# EAGLE design a78-flashcart-plus (EAGLE 7.0.0)
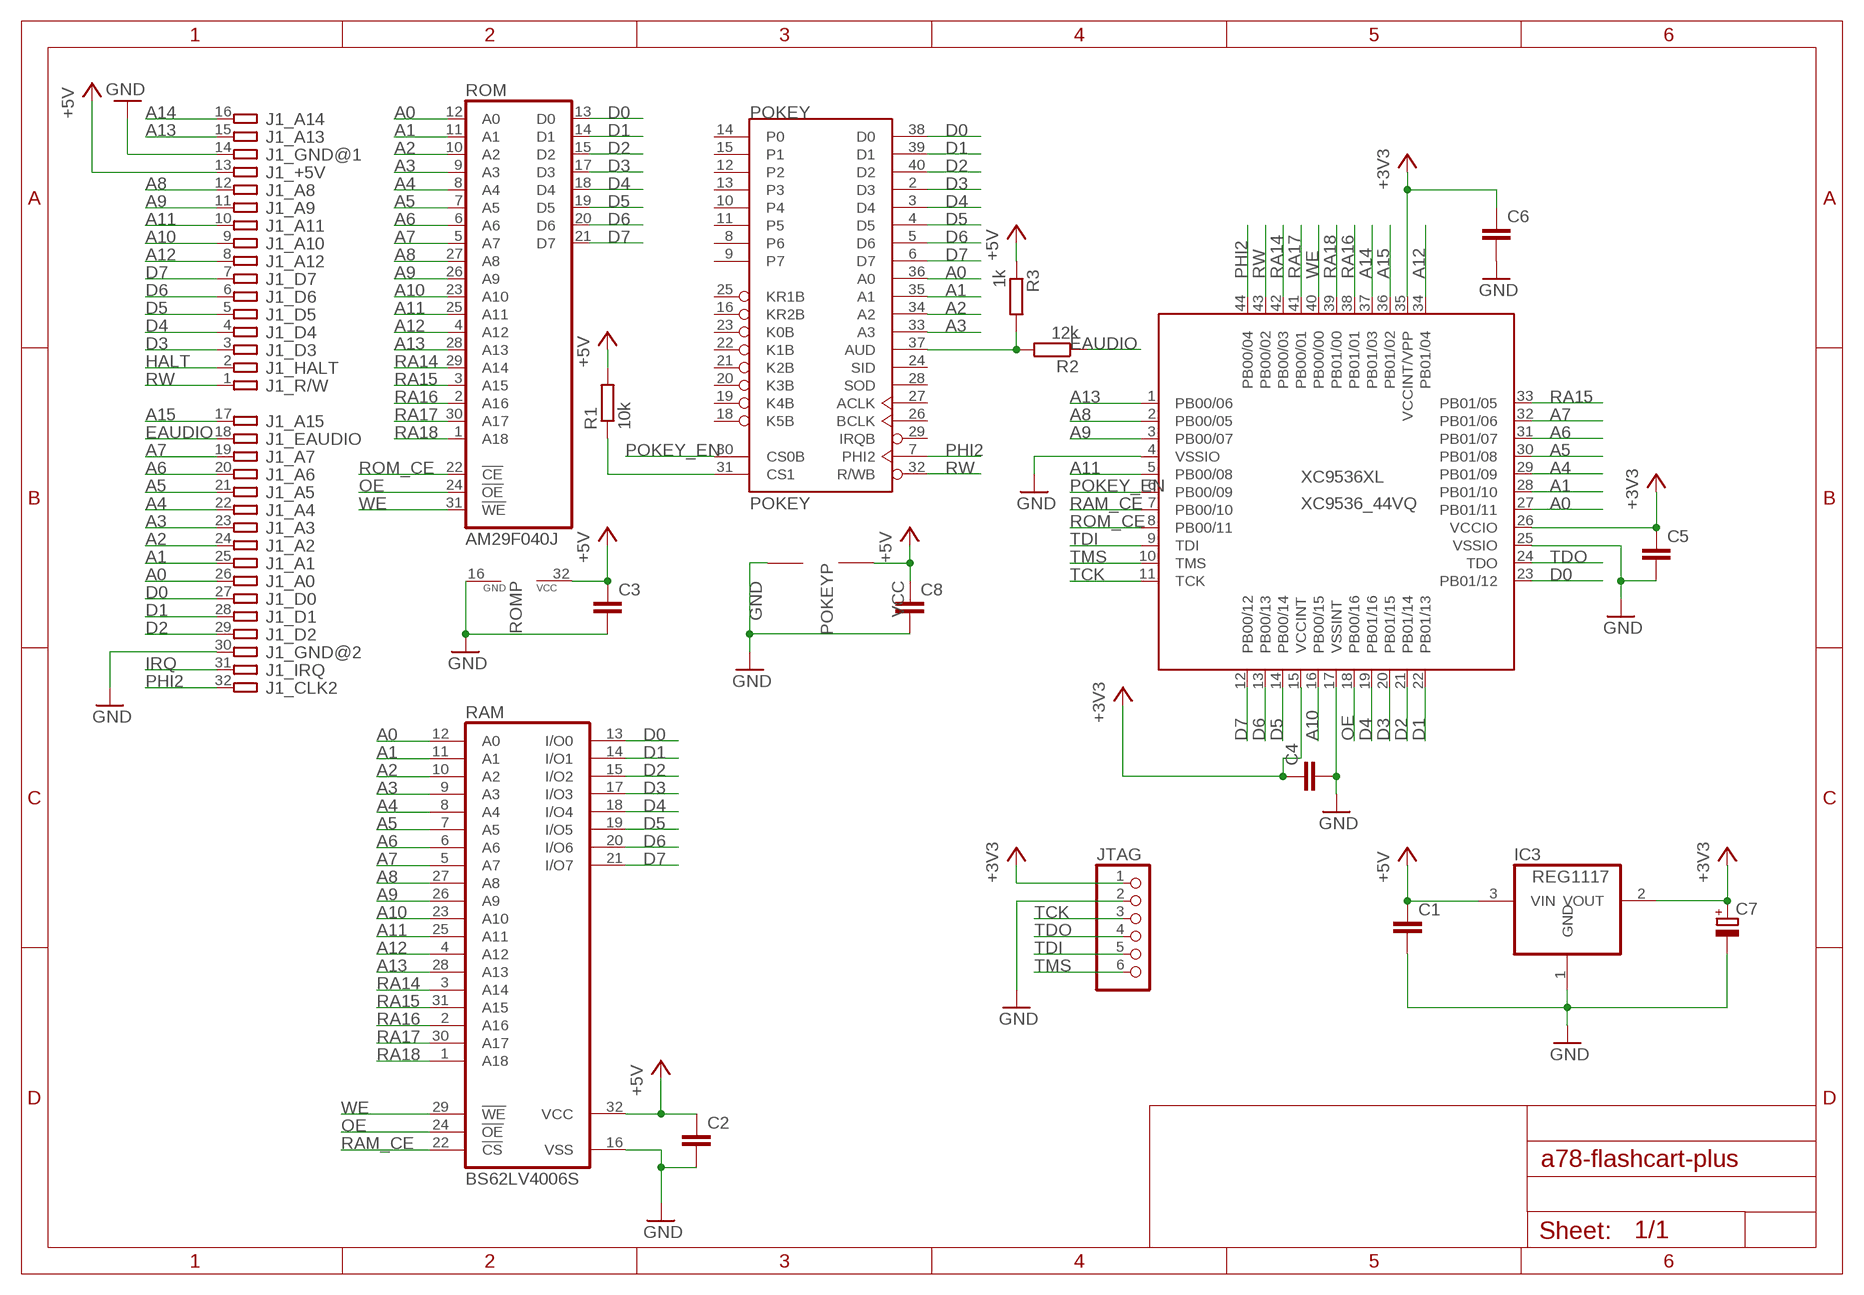
[diagram p0: schematic, sheet 1]

## Parts
C1  C-EUC0603  [C0603]
C2  C-EUC0603  [C0603]
C3  C-EUC0603  [C0603]
C4  C-EUC0603  [C0603]
C5  C-EUC0603  [C0603]
C6  C-EUC0603  [C0603]
C7  CPOL-EUSMCC  [SMC_C]
C8  C-EUC0603  [C0603]
IC3  REG1117  [SOT223]
J1  ATARI-7800-LARGE  [ATARI-7800-LARGE]
JTAG  PINHD-1X6  [1X06]
POKEY  POKEY  [DIL40]
R1  10k  R-EU_R0603  [R0603]
R2  12k  R-EU_R0603  [R0603]
R3  1k  R-EU_R0603  [R0603]
RAM  BS62LV4006S  [SOP-32]
ROM  AM29F040J  [PLCC32R]
XC9536XL  XC9536_44VQ  [SQFP-S-10X10-44]

## Nets
+3V3: C4.1 C5.1 C6.1 C7.+ IC3.2(VOUT) JTAG.1 XC9536XL.15(VCCINT) XC9536XL.26(VCCIO) XC9536XL.35(VCCINT/VPP)
+5V: C1.1 C2.1 C3.1 C8.1 IC3.3(VIN) J1.13 POKEY.17(VCC) R1.2 R3.1 RAM.32(VCC) ROM.32(VCC)
A0: J1.26 POKEY.36(A0) RAM.12(A0) ROM.12(A0) XC9536XL.27(PB01/11)
A1: J1.25 POKEY.35(A1) RAM.11(A1) ROM.11(A1) XC9536XL.28(PB01/10)
A2: J1.24 POKEY.34(A2) RAM.10(A2) ROM.10(A2)
A3: J1.23 POKEY.33(A3) RAM.9(A3) ROM.9(A3)
A4: J1.22 RAM.8(A4) ROM.8(A4) XC9536XL.29(PB01/09)
A5: J1.21 RAM.7(A5) ROM.7(A5) XC9536XL.30(PB01/08)
A6: J1.20 RAM.6(A6) ROM.6(A6) XC9536XL.31(PB01/07)
A7: J1.19 RAM.5(A7) ROM.5(A7) XC9536XL.32(PB01/06)
A8: J1.12 RAM.27(A8) ROM.27(A8) XC9536XL.2(PB00/05)
A9: J1.11 RAM.26(A9) ROM.26(A9) XC9536XL.3(PB00/07)
A10: J1.9 RAM.23(A10) ROM.23(A10) XC9536XL.16(PB00/15)
A11: J1.10 RAM.25(A11) ROM.25(A11) XC9536XL.5(PB00/08)
A12: J1.8 RAM.4(A12) ROM.4(A12) XC9536XL.34(PB01/04)
A13: J1.15 RAM.28(A13) ROM.28(A13) XC9536XL.1(PB00/06)
A14: J1.16 XC9536XL.37(PB01/03)
A15: J1.17 XC9536XL.36(PB01/02)
D0: J1.27 POKEY.38(D0) RAM.13(I/O0) ROM.13(D0) XC9536XL.23(PB01/12)
D1: J1.28 POKEY.39(D1) RAM.14(I/O1) ROM.14(D1) XC9536XL.22(PB01/13)
D2: J1.29 POKEY.40(D2) RAM.15(I/O2) ROM.15(D2) XC9536XL.21(PB01/14)
D3: J1.3 POKEY.2(D3) RAM.17(I/O3) ROM.17(D3) XC9536XL.20(PB01/15)
D4: J1.4 POKEY.3(D4) RAM.18(I/O4) ROM.18(D4) XC9536XL.19(PB01/16)
D5: J1.5 POKEY.4(D5) RAM.19(I/O5) ROM.19(D5) XC9536XL.14(PB00/14)
D6: J1.6 POKEY.5(D6) RAM.20(I/O6) ROM.20(D6) XC9536XL.13(PB00/13)
D7: J1.7 POKEY.6(D7) RAM.21(I/O7) ROM.21(D7) XC9536XL.12(PB00/12)
DJGJGFJG: POKEY.31(CS1) R1.1
EAUDIO: J1.18 R2.1
GND: C1.2 C2.2 C3.2 C4.2 C5.2 C6.2 C7.- C8.2 IC3.1(GND) J1.14 J1.30 JTAG.2 POKEY.1(GND) RAM.16(VSS) ROM.16(GND) XC9536XL.4(VSSIO) XC9536XL.17(VSSINT) XC9536XL.25(VSSIO)
HALT: J1.2
IRQ: J1.31
N$3: POKEY.37(AUD) R2.2 R3.2
OE: RAM.24(!OE) ROM.24(!OE) XC9536XL.18(PB00/16)
PHI2: J1.32 POKEY.7(PHI2) XC9536XL.44(PB00/04)
POKEY_EN: POKEY.30(CS0B) XC9536XL.6(PB00/09)
RA14: RAM.3(A14) ROM.29(A14) XC9536XL.42(PB00/03)
RA15: RAM.31(A15) ROM.3(A15) XC9536XL.33(PB01/05)
RA16: RAM.2(A16) ROM.2(A16) XC9536XL.38(PB01/01)
RA17: RAM.30(A17) ROM.30(A17) XC9536XL.41(PB00/01)
RA18: RAM.1(A18) ROM.1(A18) XC9536XL.39(PB01/00)
RAM_CE: RAM.22(!CS) XC9536XL.7(PB00/10)
ROM_CE: ROM.22(!CE) XC9536XL.8(PB00/11)
RW: J1.1 POKEY.32(R/WB) XC9536XL.43(PB00/02)
TCK: JTAG.3 XC9536XL.11(TCK)
TDI: JTAG.5 XC9536XL.9(TDI)
TDO: JTAG.4 XC9536XL.24(TDO)
TMS: JTAG.6 XC9536XL.10(TMS)
WE: RAM.29(!WE) ROM.31(!WE) XC9536XL.40(PB00/00)
Unconnected: POKEY.8(P6) POKEY.9(P7) POKEY.10(P4) POKEY.11(P5) POKEY.12(P2) POKEY.13(P3) POKEY.14(P0) POKEY.15(P1) POKEY.16(KR2B) POKEY.18(K5B) POKEY.19(K4B) POKEY.20(K3B) POKEY.21(K2B) POKEY.22(K1B) POKEY.23(K0B) POKEY.24(SID) POKEY.25(KR1B) POKEY.26(BCLK) POKEY.27(ACLK) POKEY.28(SOD) POKEY.29(IRQB)

## Library data of the parts
C1-C6 C8 = resistor:C-EU: CAPACITOR, European symbol
C7 = resistor:CPOL-EU: POLARIZED CAPACITOR, European symbol
IC3 = burr-brown:REG1117: 800mA and 1A Low Dropout (LDO) Positive Regulator 1.8V, 2.5V, 2.85V, 3.3V, 5V, and Adj; MPN: REG1117; OC_FARNELL: 1097566; OC_NEWARK: 14P6981
J1 = atari-7800-tdi:ATARI-7800: Atari 7800 cartridge board
JTAG = adafruit:PINHD-1X6: PIN HEADER
POKEY = atari-chips-mod:POKEY
R1-R3 = resistor:R-EU_: RESISTOR, European symbol
RAM = memory-bsi:BS62LV4006
ROM = am29-memory:AM29F040J: 4-Megabit FLASH MEMORY (512 K x 8 bit) 5 V-only
XC9536XL = xilinx-xc9:XC9536_44VQ: xc9536_pc44 XC9500 In-System Programmable CPLD Family Auto generated by make-symbol-device-package-bsdl.ulp Rev. 34 Source: xc9536_vq44.bsd; MPN: XC9536-15VQG44C; OC_FARNELL: 1193227; OC_NEWARK: 98K3377

## Board
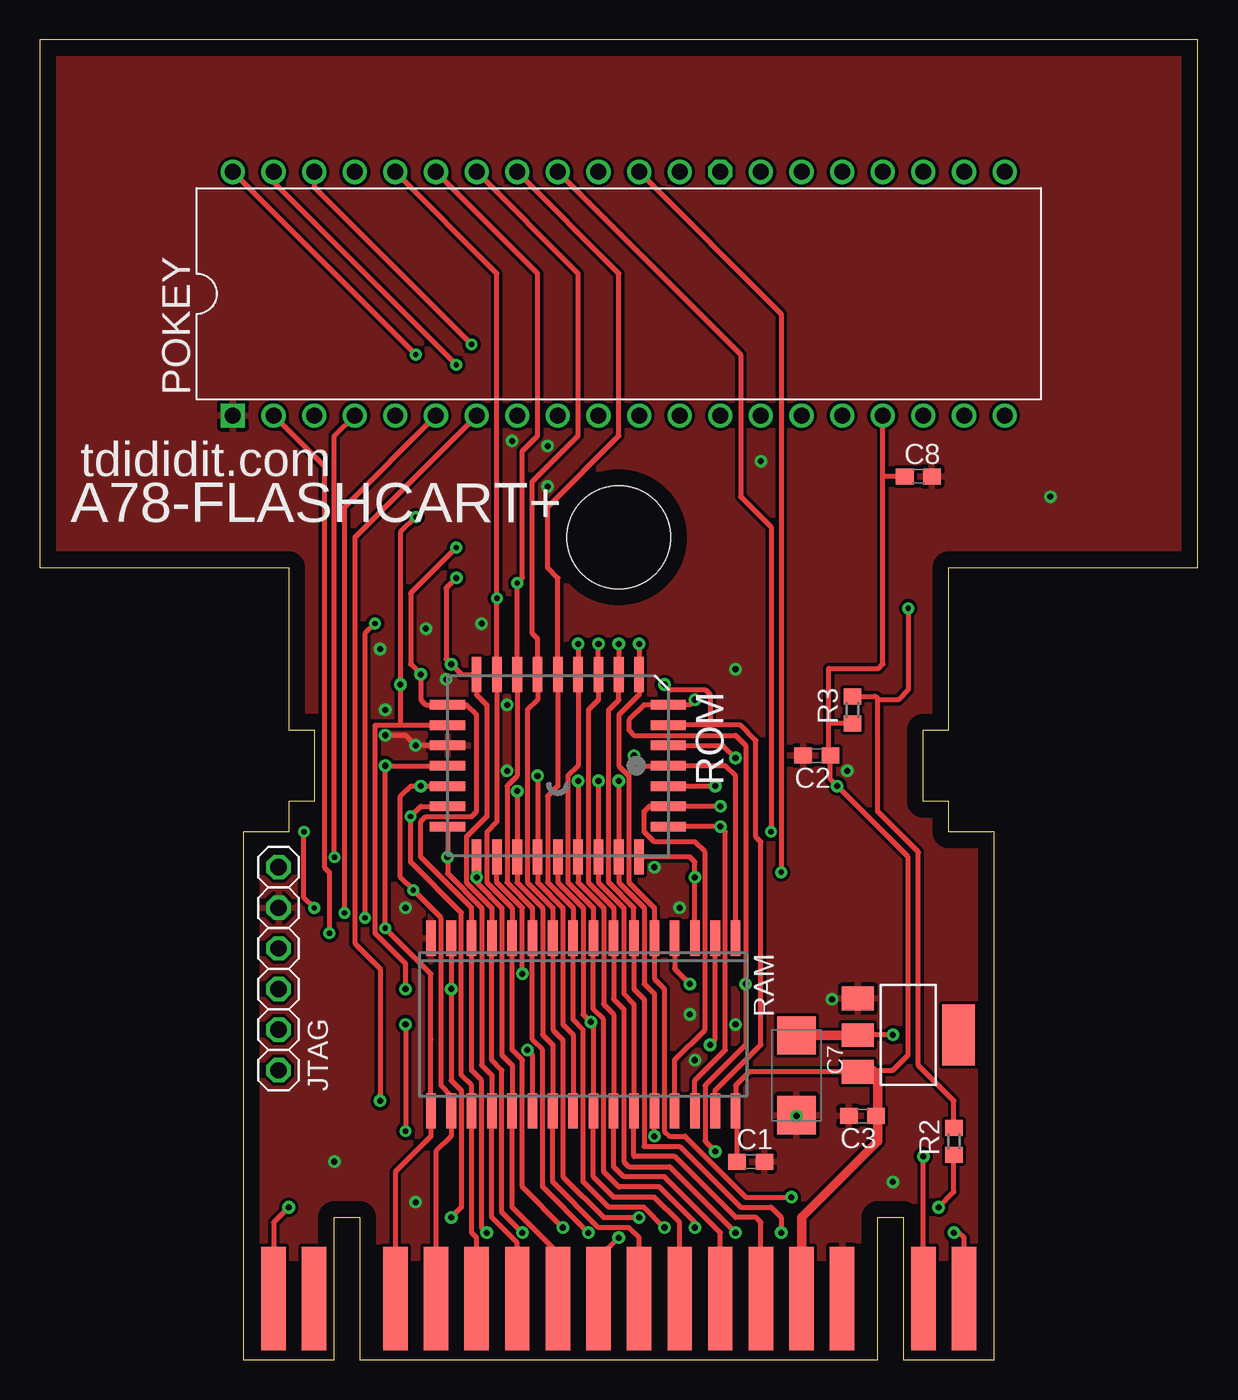
[diagram p1: board, top side]
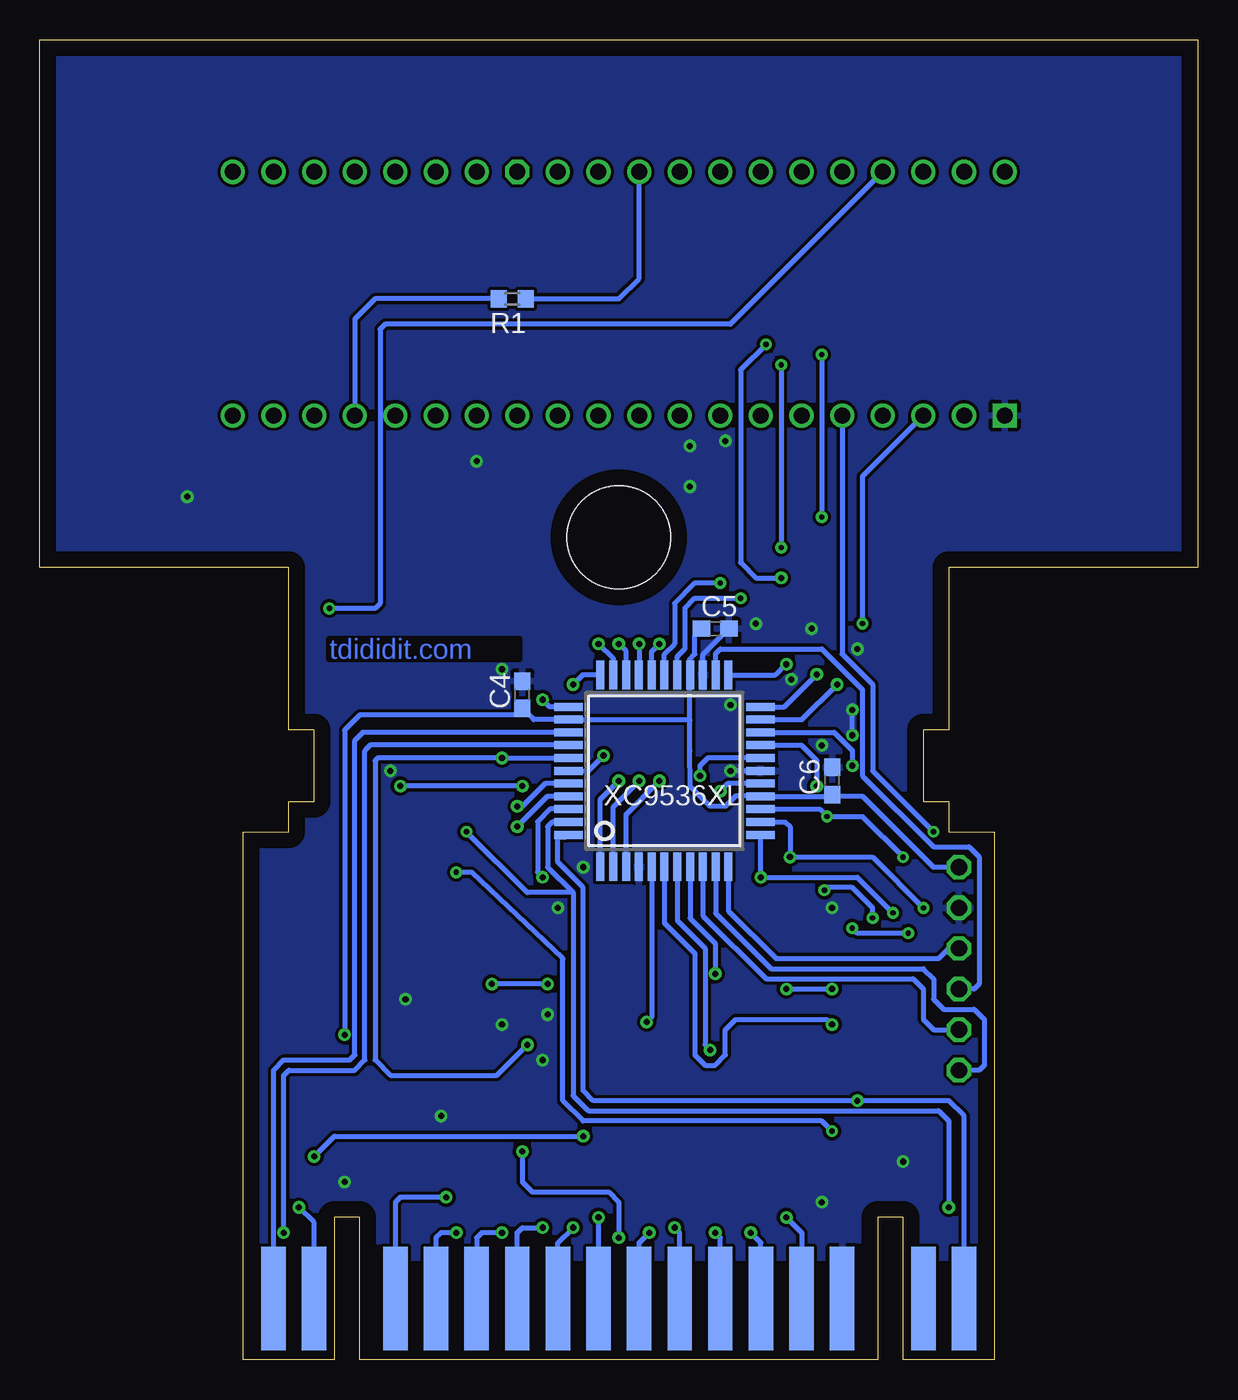
[diagram p2: board, bottom side, seen from below]

Size 72.39 x 82.55 mm. Coordinates in mm from the lower left corner, seen from the top.
Copper layers (1*16): Top 0.035mm / dielectric 1.5mm / Bottom 0.035mm
Design rules "default": minimum track width 10mil, minimum drill 24mil, track to track 8mil, track to pad 8mil, pad to pad 8mil, via to via 8mil, smd to smd 8mil, copper to edge 40mil, drill to drill 8mil, minimum pad ring 10mil, minimum via ring 8mil, stop-mask expansion 4mil, vias tented up to drill 0mil, thermal gap 10mil

### Footprints (pad centres in the part's own frame; a part is rotated, then mirrored left to right if it is on the bottom)
C0603 = smd 1.1 x 1: 1 -0.85,0; 2 0.85,0
SMC_C = smd 2.4 x 2.4: + -2.5,0; - 2.5,0
SOT223 = smd 1.499 x 2.007: 1 -2.261,-3.15; 2 0.025,-3.15; 3 2.311,-3.15 | smd 3.81 x 2.007: 4 0,3.15
ATARI-7800-LARGE = smd 1.524 x 6.477: 1 -21.59,3.81; 2 -19.05,3.81; 3 -13.97,3.81; 4 -11.43,3.81; 5 -8.89,3.81; 6 -6.35,3.81; 7 -3.81,3.81; 8 -1.27,3.81; 9 1.27,3.81; 10 3.81,3.81; 11 6.35,3.81; 12 8.89,3.81; 13 11.43,3.81; 14 13.97,3.81; 15 19.05,3.81; 16 21.59,3.81 | smd 1.524 x 6.477 bottom: 17 21.59,3.81; 18 19.05,3.81; 19 13.97,3.81; 20 11.43,3.81; 21 8.89,3.81; 22 6.35,3.81; 23 3.81,3.81; 24 1.27,3.81; 25 -1.27,3.81; 26 -3.81,3.81; 27 -6.35,3.81; 28 -8.89,3.81; 29 -11.43,3.81; 30 -13.97,3.81; 31 -19.05,3.81; 32 -21.59,3.81 | hole 6.452: 0,51.435
1X06 = drill 1.016 octagon: 1 -6.35,0; 2 -3.81,0; 3 -1.27,0; 4 1.27,0; 5 3.81,0; 6 6.35,0
DIL40 = drill 1 square: 1 -24.13,-7.62 | drill 1: 2 -21.59,-7.62; 3 -19.05,-7.62; 4 -16.51,-7.62; 5 -13.97,-7.62; 6 -11.43,-7.62; 7 -8.89,-7.62; 8 -6.35,-7.62; 9 -3.81,-7.62; 10 -1.27,-7.62; 11 1.27,-7.62; 12 3.81,-7.62; 13 6.35,-7.62; 14 8.89,-7.62; 15 11.43,-7.62; 16 13.97,-7.62; 17 16.51,-7.62; 18 19.05,-7.62; 19 21.59,-7.62; 20 24.13,-7.62; 21 24.13,7.62; 22 21.59,7.62; 23 19.05,7.62; 24 16.51,7.62; 25 13.97,7.62; 26 11.43,7.62; 27 8.89,7.62; 29 3.81,7.62; 30 1.27,7.62; 31 -1.27,7.62; 32 -3.81,7.62; 33 -6.35,7.62; 34 -8.89,7.62; 35 -11.43,7.62; 36 -13.97,7.62; 37 -16.51,7.62; 38 -19.05,7.62; 39 -21.59,7.62; 40 -24.13,7.62 | drill 1 octagon: 28 6.35,7.62
R0603 = smd 1 x 1.1: 1 -0.85,0; 2 0.85,0
SOP-32 = smd 0.6 x 2.2: 1 -9.525,-5.4; 2 -8.255,-5.4; 3 -6.985,-5.4; 4 -5.715,-5.4; 5 -4.445,-5.4; 6 -3.175,-5.4; 7 -1.905,-5.4; 8 -0.635,-5.4; 9 0.635,-5.4; 10 1.905,-5.4; 11 3.175,-5.4; 12 4.445,-5.4; 13 5.715,-5.4; 14 6.985,-5.4; 15 8.255,-5.4; 16 9.525,-5.4; 17 9.525,5.4; 18 8.255,5.4; 19 6.985,5.4; 20 5.715,5.4; 21 4.445,5.4; 22 3.175,5.4; 23 1.905,5.4; 24 0.635,5.4; 25 -0.635,5.4; 26 -1.905,5.4; 27 -3.175,5.4; 28 -4.445,5.4; 29 -5.715,5.4; 30 -6.985,5.4; 31 -8.255,5.4; 32 -9.525,5.4
PLCC32R = smd 0.6 x 2.2: 1 0,6.9; 2 -1.27,6.9; 3 -2.54,6.9; 4 -3.81,6.9; 14 -3.81,-6.9; 15 -2.54,-6.9; 16 -1.27,-6.9; 17 0,-6.9; 18 1.27,-6.9; 19 2.54,-6.9; 20 3.81,-6.9; 30 3.81,6.9; 31 2.54,6.9; 32 1.27,6.9 | smd 2.2 x 0.6: 5 -5.7,5.08; 6 -5.7,3.81; 7 -5.7,2.54; 8 -5.7,1.27; 9 -5.7,0; 10 -5.7,-1.27; 11 -5.7,-2.54; 12 -5.7,-3.81; 13 -5.7,-5.08; 21 5.7,-5.08; 22 5.7,-3.81; 23 5.7,-2.54; 24 5.7,-1.27; 25 5.7,0; 26 5.7,1.27; 27 5.7,2.54; 28 5.7,3.81; 29 5.7,5.08
SQFP-S-10X10-44 = smd 0.5 x 1.8: 1 -4,-6; 2 -3.2,-6; 3 -2.4,-6; 4 -1.6,-6; 5 -0.8,-6; 6 0,-6; 7 0.8,-6; 8 1.6,-6; 9 2.4,-6; 10 3.2,-6; 11 4,-6; 23 4,6; 24 3.2,6; 25 2.4,6; 26 1.6,6; 27 0.8,6; 28 0,6; 29 -0.8,6; 30 -1.6,6; 31 -2.4,6; 32 -3.2,6; 33 -4,6 | smd 1.8 x 0.5: 12 6,-4; 13 6,-3.2; 14 6,-2.4; 15 6,-1.6; 16 6,-0.8; 17 6,0; 18 6,0.8; 19 6,1.6; 20 6,2.4; 21 6,3.2; 22 6,4; 34 -6,4; 35 -6,3.2; 36 -6,2.4; 37 -6,1.6; 38 -6,0.8; 39 -6,0; 40 -6,-0.8; 41 -6,-1.6; 42 -6,-2.4; 43 -6,-3.2; 44 -6,-4

### Placement (x,y rotation side)
C1  44.45,12.38 0 top
C2  48.58,37.78 180 top
C3  51.43,15.24 180 top
C4  42.23,41.59 90 bottom
C5  30.16,45.72 0 bottom
C6  22.86,36.2 90 bottom
C7  47.31,17.78 270 top
C8  54.93,55.25 0 top
IC3  54.29,20.32 270 top
J1  36.2,0 0 top
JTAG  14.92,24.45 270 top
POKEY  36.2,66.67 0 top
R1  42.86,66.36 180 bottom
R2  57.15,13.65 90 top
R3  50.8,40.64 90 top
RAM  33.97,20.95 180 top
ROM  32.38,37.15 270 top
XC9536XL  33.34,36.83 0 bottom

### Tracks (layer width: path | path; a pad name or v marks a point on that pad's centre or on a via)
+3V3  (via drill 0.38)
  Top 0.305: v53.34,20.32 51.17,20.32 IC3.2
  Top 0.61: C7.+ 51.13,20.28 IC3.2
  Bottom 0.305: JTAG.1 16.51,30.8 20.95,35.24 22.76,35.24 C6.1 22.97,35.23 XC9536XL.15 27.35,35.24 28.89,35.24 29.53,34.61 30.48,34.61 31.74,35.87 31.75,38.1 31.75,40.01 | 31.75,40.01 31.77,40.03 XC9536XL.35 41.52,40.03 C4.1 42.65,40.32 52.39,40.32 53.34,39.37 v53.34,20.32 | 31.75,40.01 31.75,42.82 XC9536XL.26 31.76,43.59 31.76,43.8 31.43,44.13 31.43,45.3 C5.1
+5V  (via drill 0.38)
  Top 0.305: IC3.3 44.36,18.01 43.5,17.14 RAM.32 43.6,15.45 C1.1 | ROM.32 v42.23,35.88 | 52.07,18.1 53.34,18.1 54.29,19.05 54.29,31.43 v49.85,35.88 49.43,36.3 C2.1 49.34,37.87 49.34,40.01 | 52.7,55.25 52.7,43.5 52.45,43.24 49.34,43.24 49.34,40.01 | 52.7,55.25 POKEY.17 | R3.1 49.55,39.79 arc-90 49.34,40.01 | C8.1 52.7,55.25
  Top 0.61: J1.13 47.62,8.89 52.39,13.65 52.39,15.24 | 52.39,15.24 52.39,17.78 52.07,18.1 51.23,18.1 IC3.3 | C3.1 52.39,15.24
  Bottom 0.305: v42.23,35.88 v49.85,35.88 | R1.2 51.43,66.36 52.7,65.09 POKEY.17
A0  (via drill 0.33, 0.38)
  Top 0.305: v32.7,8.26 30.16,10.79 30.16,18.73 29.53,19.37 RAM.12 29.53,28.26 27.94,29.84 27.94,33.02 28.57,33.66 ROM.12 v28.57,47.62 28.57,67.94 POKEY.36
  Bottom 0.305: J1.26 32.38,7.94 v32.7,8.26 | XC9536XL.27 32.54,43.98 32.07,44.45 32.07,46.99 31.43,47.62 v28.57,47.62
A1  (via drill 0.33, 0.38)
  Top 0.305: v34.29,7.94 31.43,10.79 31.43,19.37 30.8,20 RAM.11 30.8,28.26 29.21,29.84 29.21,35.88 29.84,36.51 ROM.11 v29.84,48.58 30.16,48.9 30.16,56.83 31.11,57.79 31.11,67.94 POKEY.35
  Bottom 0.305: J1.25 34.92,7.3 v34.29,7.94 | XC9536XL.28 33.34,44.13 32.7,44.77 32.7,47.31 31.43,48.58 v29.84,48.58
A2  (via drill 0.38)
  Top 0.305: v37.46,8.89 35.24,8.89 32.7,11.43 32.7,20 32.07,20.64 RAM.10 32.07,28.26 30.48,29.84 30.48,40.64 31.11,41.27 ROM.10 31.11,45.09 30.8,45.4 30.8,54.93 33.66,57.79 33.66,67.94 POKEY.34
  Bottom 0.305: v37.46,8.89 J1.24
A3  (via drill 0.38)
  Top 0.305: v39.05,8.26 37.78,9.53 35.56,9.53 33.97,11.11 33.97,20.64 33.34,21.27 RAM.9 33.34,28.26 31.75,29.84 31.75,35.24 32.38,35.88 ROM.9 32.38,48.9 31.75,49.53 31.75,53.34 36.2,57.79 36.2,67.94 POKEY.33
  Bottom 0.305: J1.23 40,7.3 v39.05,8.26
A4  (via drill 0.38)
  Top 0.305: v40.96,8.26 40.96,8.57 38.73,10.79 36.2,10.79 35.24,11.75 35.24,21.27 34.61,21.91 RAM.8 34.61,28.26 33.02,29.84 33.02,36.51 33.66,37.15 ROM.8 v33.66,44.77
  Bottom 0.305: J1.22 42.54,7.94 42.23,8.26 v40.96,8.26 | XC9536XL.29 34.14,44.29 v33.66,44.77
A5  (via drill 0.38)
  Top 0.305: v43.5,7.94 39.37,12.06 36.83,12.06 36.51,12.38 36.51,21.91 35.88,22.54 RAM.7 35.88,28.26 34.29,29.84 34.29,40.64 34.92,41.27 ROM.7 v34.92,44.77
  Bottom 0.305: v43.5,7.94 44.77,7.94 45.09,7.62 J1.21 | v34.92,44.77 ROM.7 XC9536XL.30
A6  (via drill 0.38)
  Top 0.305: v46.35,7.94 46.35,8.89 45.72,9.53 43.81,9.53 40,13.34 37.78,13.34 37.78,22.54 37.15,23.18 RAM.6 37.15,28.26 35.56,29.84 35.56,40.64 36.2,41.27 ROM.6 v36.2,44.77
  Bottom 0.305: v46.35,7.94 47.31,7.94 47.62,7.62 J1.20 | XC9536XL.31 35.74,44.31 v36.2,44.77
A7  (via drill 0.38)
  Top 0.305: v46.99,10.16 44.13,10.16 40.32,13.97 39.37,13.97 39.05,14.29 39.05,23.18 38.42,23.81 RAM.5 38.42,28.26 36.83,29.84 36.83,36.51 36.2,37.15 36.2,40.32 37.46,41.59 ROM.5 v37.46,44.77
  Bottom 0.305: v46.99,10.16 49.85,10.16 50.16,9.84 J1.19 | XC9536XL.32 36.54,43.84 v37.46,44.77
A8  (via drill 0.38)
  Top 0.305: J1.12 45.09,8.57 44.77,8.89 43.5,8.89 39.69,12.7 37.15,12.7 RAM.27 37.15,22.22 36.51,22.86 36.51,28.26 34.92,29.84 ROM.27 v34.92,36.2
  Bottom 0.305: XC9536XL.2 36.54,34.58 v34.92,36.2
A9  (via drill 0.38)
  Top 0.305: J1.11 42.54,7.94 39.05,11.43 36.51,11.43 35.88,12.06 RAM.26 35.88,21.59 35.24,22.22 35.24,28.26 33.66,29.84 ROM.26 v33.66,36.2
  Bottom 0.305: XC9536XL.3 35.74,34.11 v33.66,36.2
A10  (via drill 0.38)
  Top 0.305: J1.9 37.46,7.62 36.83,8.26 34.92,8.26 32.07,11.11 RAM.23 32.07,19.68 31.43,20.32 31.43,28.26 29.84,29.84 ROM.23 v29.84,35.56
  Bottom 0.305: XC9536XL.16 29.37,36.03 v29.84,35.56
A11  (via drill 0.38)
  Top 0.305: ROM.25 32.38,29.84 33.97,28.26 33.97,21.59 v34.45,21.11 34.61,20.95 RAM.25 34.61,11.43 35.88,10.16 38.42,10.16 40,8.57 J1.10
  Bottom 0.305: XC9536XL.5 34.14,21.42 v34.45,21.11
A12  (via drill 0.38)
  Top 0.305: v42.23,13.02 41.59,13.65 41.59,17.14 44.13,19.68 v44.13,23.49 44.13,38.42 43.5,39.05 37.15,39.05 36.83,39.37 36.83,40.01 37.78,40.96 ROM.4 40.64,40.96 v40.96,41.27 | v36.2,7.62 34.92,6.35 J1.8 | RAM.4 39.69,24.45 v40.64,23.49
  Bottom 0.305: v42.23,13.02 42.23,11.11 41.59,10.48 36.83,10.48 36.2,9.84 v36.2,7.62 | v40.64,23.49 v44.13,23.49 | XC9536XL.34 40.51,40.83 v40.96,41.27
A13  (via drill 0.38)
  Top 0.305: J1.15 v55.24,12.7 | v38.42,13.97 RAM.28 38.42,22.86 37.78,23.49 37.78,28.26 36.2,29.84 ROM.28 v36.2,36.2
  Bottom 0.305: v55.24,12.7 53.98,13.97 v38.42,13.97 | XC9536XL.1 37.34,35.05 v36.2,36.2
A14  (via drill 0.38)
  Top 0.305: J1.16 57.78,7.62 57.47,7.94 v57.15,7.94
  Bottom 0.305: v57.15,7.94 57.15,17.78 56.83,18.1 52.7,18.1 52.07,18.73 52.07,38.1 51.74,38.43 XC9536XL.37
A15
  Bottom 0.305: J1.17 57.78,18.1 57.15,18.73 53.02,18.73 52.7,19.05 52.7,38.73 52.21,39.23 XC9536XL.36
D0  (via drill 0.33, 0.38)
  Top 0.305: v30.16,7.94 28.89,9.21 28.89,18.1 28.26,18.73 RAM.13 28.26,28.26 26.67,29.84 26.67,32.7 27.94,33.97 27.94,40.94 27.3,41.58 ROM.13 26.37,42.85 v25.72,43.5 25.4,43.82 25.4,48.26 v26.03,48.9 | POKEY.38 17.14,73.34 v26.99,63.5
  Bottom 0.305: J1.27 29.84,7.62 v30.16,7.94 | XC9536XL.23 26.38,42.83 v25.72,43.5 | v26.99,63.5 28.57,61.91 28.57,49.85 27.62,48.9 v26.03,48.9
D1  (via drill 0.33, 0.38)
  Top 0.305: v27.94,7.94 27.62,8.26 27.62,17.46 26.99,18.1 RAM.14 26.99,28.26 23.81,31.43 23.81,33.66 24.13,33.97 26.99,33.97 27.3,34.29 27.3,40.32 26.67,40.96 ROM.14 24.13,40.96 23.81,41.27 v23.81,42.86 23.18,43.5 23.18,47.94 v26.03,50.8 | POKEY.39 14.6,73.66 v26.03,62.23
  Bottom 0.305: J1.28 27.3,7.3 v27.94,7.94 | XC9536XL.22 25.84,40.83 v23.81,42.86 | v26.03,62.23 v26.03,50.8
D2  (via drill 0.33, 0.38)
  Top 0.305: v25.72,8.89 26.35,9.53 26.35,16.83 25.72,17.46 v25.72,23.18 RAM.15 | 22.54,39.69 v22.54,42.23 22.54,51.75 v23.49,52.71 | v22.86,23.18 22.86,24.76 20.95,26.67 20.95,39.69 22.54,39.69 | 22.54,39.69 ROM.15 | POKEY.40 v23.49,62.87
  Bottom 0.305: v25.72,8.89 24.76,7.94 J1.29 | XC9536XL.21 24.74,40.03 v22.54,42.23 | v25.72,23.18 v22.86,23.18 | v23.49,62.87 v23.49,52.71
D3  (via drill 0.33, 0.38)
  Top 0.305: J1.3 22.22,11.75 24.45,13.97 RAM.17 24.45,20 24.44,24.13 v21.59,26.98 v21.59,37.15 ROM.17 | POKEY.2 17.78,55.88 17.78,30.8 18.1,30.48 v18.1,26.67
  Bottom 0.305: XC9536XL.20 22.72,39.23 21.59,38.1 v21.59,37.15 | v18.1,26.67 21.27,26.67 v21.59,26.98
D4  (via drill 0.33, 0.38)
  Top 0.305: J1.4 24.76,13.02 25.72,13.97 RAM.18 25.72,16.51 25.08,17.14 25.08,27.62 v23.34,29.37 22.54,30.16 22.54,35.24 23.18,35.88 v23.81,35.88 ROM.18 | v20.95,46.04 20.32,45.4 v20.32,27.62
  Bottom 0.305: XC9536XL.19 24.78,38.43 23.81,37.47 v23.81,35.88 | POKEY.3 20.95,55.25 v20.95,46.04 | v20.32,27.62 20.32,28.26 21.59,29.53 23.18,29.53 v23.34,29.37
D5  (via drill 0.33)
  Top 0.305: J1.5 27.3,7.62 26.99,7.94 RAM.19 26.99,17.14 26.35,17.78 26.35,27.94 23.18,31.11 v23.18,33.97 23.81,34.61 ROM.19 | v18.41,31.43 18.41,57.79 POKEY.4
  Bottom 0.305: XC9536XL.14 23.63,34.43 v23.18,33.97 20.95,33.97 v18.41,31.43
D6  (via drill 0.33, 0.38)
  Top 0.305: ROM.20 v25.48,31.43 25.48,30.39 27.62,28.26 27.62,18.41 28.26,17.78 RAM.20 28.26,8.89 29.84,7.3 J1.6 | v17.14,28.26 16.51,28.89 v16.51,33.02
  Bottom 0.305: XC9536XL.13 25.78,33.63 ROM.20 25.48,31.52 | 25.48,31.52 v25.48,31.43 | POKEY.5 22.22,44.13 20.32,42.23 20.32,36.83 v16.51,33.02 | 25.48,31.52 25.4,31.43 20.32,31.43 v17.14,28.26
D7  (via drill 0.33, 0.38)
  Top 0.305: J1.7 32.38,6.67 29.53,9.53 RAM.21 29.53,18.41 28.89,19.05 28.89,28.26 27.3,29.84 v27.3,30.16 ROM.21 | v19.05,27.94 19.05,53.34 POKEY.6
  Bottom 0.305: XC9536XL.12 27.34,30.19 v27.3,30.16 21.27,30.16 v19.05,27.94
DJGJGFJG
  Bottom 0.305: R1.1 36.2,66.36 34.92,67.63 POKEY.31
EAUDIO  (via drill 0.38)
  Top 0.305: v56.2,9.53 57.15,10.48 R2.1
  Bottom 0.305: J1.18 55.24,8.57 v56.2,9.53
GND  (via drill 0.38)
  Top 0.305: ROM.16 v23.49,38.42 22.86,39.05 v21.59,39.05
  Bottom 0.305: XC9536XL.25 30.94,44.09 C5.2 | XC9536XL.17 v29.21,36.83 | v21.59,39.05 v21.59,40.64
  other vias: 22.86,28.26 18.41,12.38 43.5,43.18 29.21,40.96 47.31,15.24 49.53,22.54 50.48,36.83 63.18,53.98 53.34,11.11 40.64,21.59 21.27,44.45 25.4,42.55 27.62,46.04 24.13,45.72 40,28.26 38.42,30.8 45.09,56.2 31.75,54.61 31.75,57.15 29.53,57.47 23.49,9.84 40.96,18.73 43.5,20.95
  pour Bottom (isolate 0.16): 13.33,6.35 13.33,32.39 18.1,32.39 18.1,40.01 16.19,40.01 16.19,49.21 0,49.53 0,82.55 72.71,82.87 72.71,49.21 56.52,49.21 56.52,39.69 54.93,39.69 54.93,34.61 56.83,34.61 56.83,33.02 59.69,33.02 59.69,32.7 60.32,6.35
  pour Top (isolate 0.16): 13.33,6.35 13.33,32.39 18.1,32.39 18.1,40.01 16.19,40.01 16.19,49.21 0,49.53 0,82.55 72.71,82.87 72.71,49.21 56.52,49.21 56.52,39.69 54.93,39.69 54.93,34.61 56.83,34.61 56.83,33.02 59.69,33.02 59.69,32.7 60.32,6.35
N$3  (via drill 0.33)
  Top 0.305: R2.2 57.15,16.19 54.93,18.41 54.93,31.75 52.39,34.29 52.39,41.27 | R3.2 52.17,41.49 arc-90 52.39,41.27 | v54.29,46.99 54.29,41.91 53.66,41.27 52.39,41.27
  Bottom 0.305: POKEY.37 29.21,64.77 50.8,64.77 51.12,64.45 51.12,47.31 51.43,46.99 v54.29,46.99
OE  (via drill 0.38)
  Top 0.305: RAM.24 33.34,20.32 32.7,20.95 32.7,28.26 31.11,29.84 ROM.24 v31.11,36.51
  Bottom 0.305: XC9536XL.18 30.63,37.63 31.11,37.15 v31.11,36.51
PHI2  (via drill 0.38)
  Top 0.305: v21.27,16.19 21.27,24.45 19.68,26.04 19.68,51.44 POKEY.7
  Bottom 0.305: J1.32 14.6,15.24 15.56,16.19 v21.27,16.19 37.78,16.19 38.42,16.83 38.42,29.53 40,31.11 40,32.7 39.46,32.7 XC9536XL.44
POKEY_EN  (via drill 0.33, 0.38)
  Top 0.305: POKEY.30 46.35,65.41 v46.35,30.48 | v22.86,20.95 v22.86,14.29
  Bottom 0.305: XC9536XL.6 33.34,27.3 31.43,25.4 31.43,19.05 30.8,18.41 30.16,18.41 29.53,19.05 29.53,20.64 28.89,21.27 23.18,21.27 v22.86,20.95 | v22.86,14.29 23.49,14.92 38.42,14.92 39.69,16.19 39.69,25.08 45.4,30.48 v46.35,30.48
RA14  (via drill 0.38)
  Top 0.305: RAM.3 v40.96,30.16 40.96,31.11 40.64,31.43 37.48,31.43 ROM.29
  Bottom 0.305: XC9536XL.42 40.5,34.43 41.27,33.66 41.27,30.48 v40.96,30.16
RA15  (via drill 0.38)
  Top 0.305: RAM.31 42.23,16.83 45.09,19.68 45.09,32.39 44.77,32.7 44.77,38.73 43.81,39.69 41.91,39.69 | 41.91,39.69 ROM.3 | v39.05,42.23 39.37,41.91 41.59,41.91 41.91,41.59 41.91,39.69
  Bottom 0.305: XC9536XL.33 38.45,42.83 v39.05,42.23
RA16  (via drill 0.38)
  Top 0.305: v41.91,19.68 42.23,20 RAM.2 | ROM.2 42.71,38.42 v43.5,37.63
  Bottom 0.305: v41.91,19.68 43.81,17.78 50.48,17.78 51.43,18.73 51.43,37.47 51.27,37.63 v43.5,37.63 XC9536XL.38
RA17  (via drill 0.38)
  Top 0.305: RAM.30 40.96,17.46 42.86,19.37 42.86,33.02 v42.54,33.34 ROM.30
  Bottom 0.305: XC9536XL.41 40.65,35.23 v42.54,33.34
RA18  (via drill 0.38)
  Top 0.305: RAM.1 43.5,36.51 42.86,37.15 ROM.1 37.78,37.15 v37.15,37.78
  Bottom 0.305: XC9536XL.39 38.1,36.83 v37.15,37.78
RAM_CE  (via drill 0.38)
  Top 0.305: v30.48,19.37 30.8,19.05 RAM.22
  Bottom 0.305: XC9536XL.7 32.54,27.46 30.8,25.72 30.8,19.68 v30.48,19.37
ROM_CE  (via drill 0.38)
  Top 0.305: v30.16,24.13 30.16,28.26 28.57,29.84 ROM.22
  Bottom 0.305: XC9536XL.8 31.74,27.61 30.16,26.04 v30.16,24.13
RW  (via drill 0.33, 0.38)
  Top 0.305: v15.56,9.53 14.6,8.57 J1.1 | POKEY.32 43.81,62.87 43.81,53.98 45.72,52.07 v45.72,33.02
  Bottom 0.305: 39.05,29.21 39.05,16.51 38.1,15.56 16.19,15.56 15.56,14.92 v15.56,9.53 | XC9536XL.43 40.35,33.63 40.64,33.34 40.64,30.8 39.05,29.21 | 39.05,29.21 41.91,29.21 v45.72,33.02
TCK
  Bottom 0.305: XC9536XL.11 29.34,28.07 26.35,25.08 16.19,25.08 15.56,25.72 JTAG.3
TDI
  Bottom 0.305: XC9536XL.9 30.94,27.76 26.99,23.81 17.78,23.81 17.14,23.18 17.14,21.27 16.51,20.64 JTAG.5
TDO
  Bottom 0.305: XC9536XL.24 30.14,44.16 29.84,44.45 23.49,44.45 20.95,41.91 20.95,36.51 16.51,32.07 14.29,32.07 13.65,31.43 13.65,23.49 13.97,23.18 JTAG.4
TMS
  Bottom 0.305: XC9536XL.10 30.14,27.91 26.67,24.45 17.14,24.45 16.51,23.81 16.51,22.54 15.87,21.91 13.97,21.91 13.33,21.27 13.33,18.41 13.65,18.1 JTAG.6
WE  (via drill 0.38)
  Top 0.305: RAM.29 39.69,18.73 41.59,20.64 41.59,31.75 40.96,32.39 38.42,32.39 37.78,33.02 37.78,34.29 38.1,34.61 ROM.31 v42.54,34.61
  Bottom 0.305: XC9536XL.40 40.8,36.03 42.23,34.61 v42.54,34.61

### Text on the board
Bottom: tdididit.com
tPlace: A78-FLASHCART+
tNames: tdididit.com